# EasyEDA Pro project PCB_SCH_Left_Main.epro

# Schematic left_main

## Sheets
1 led and button: Board Name: left_main; Create Date: 2025-10-24; Page Name: led and button; Project Name: SCH_left_main; Schematic Name: left_main; Update Date: 2025-10-23; Add into BOM: yes; Company: Your Company; Convert to PCB: yes; Date: 10/24/2025; Draw By: Habana; REV: 1.0; Sheet: 1/1; spicePre: .
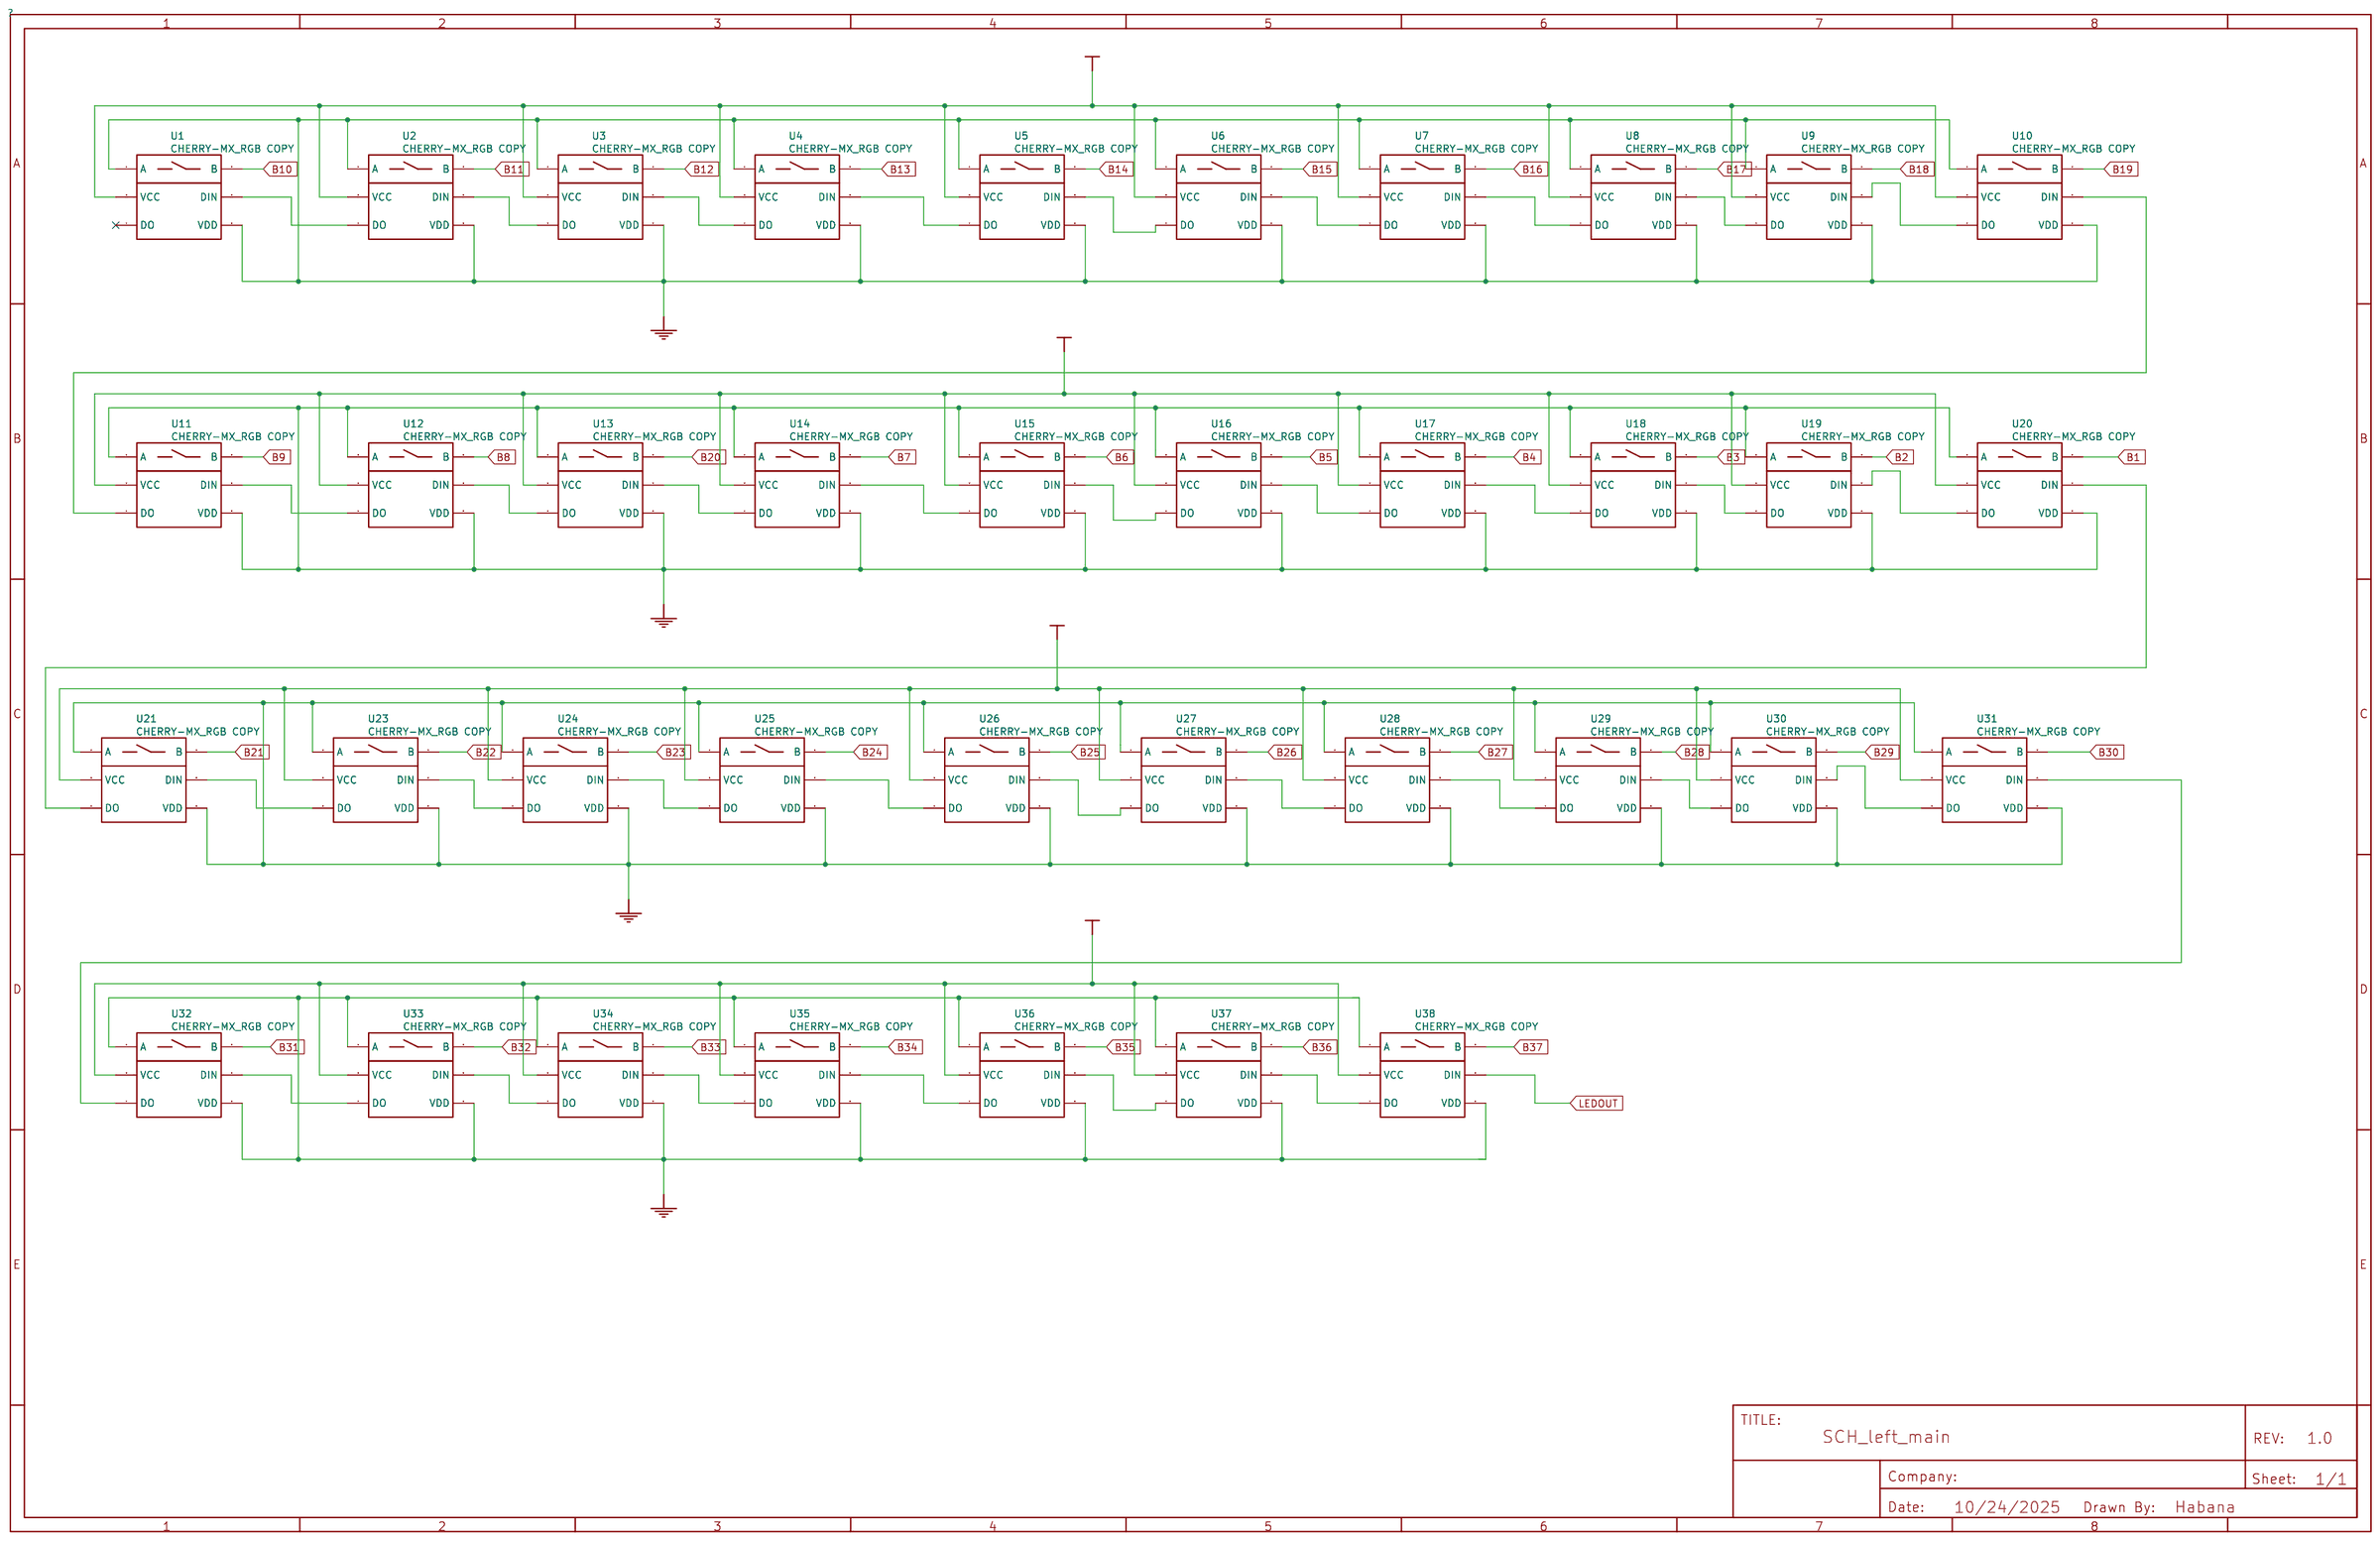
[diagram p0: led and button]
2 drivers: Page Name: drivers
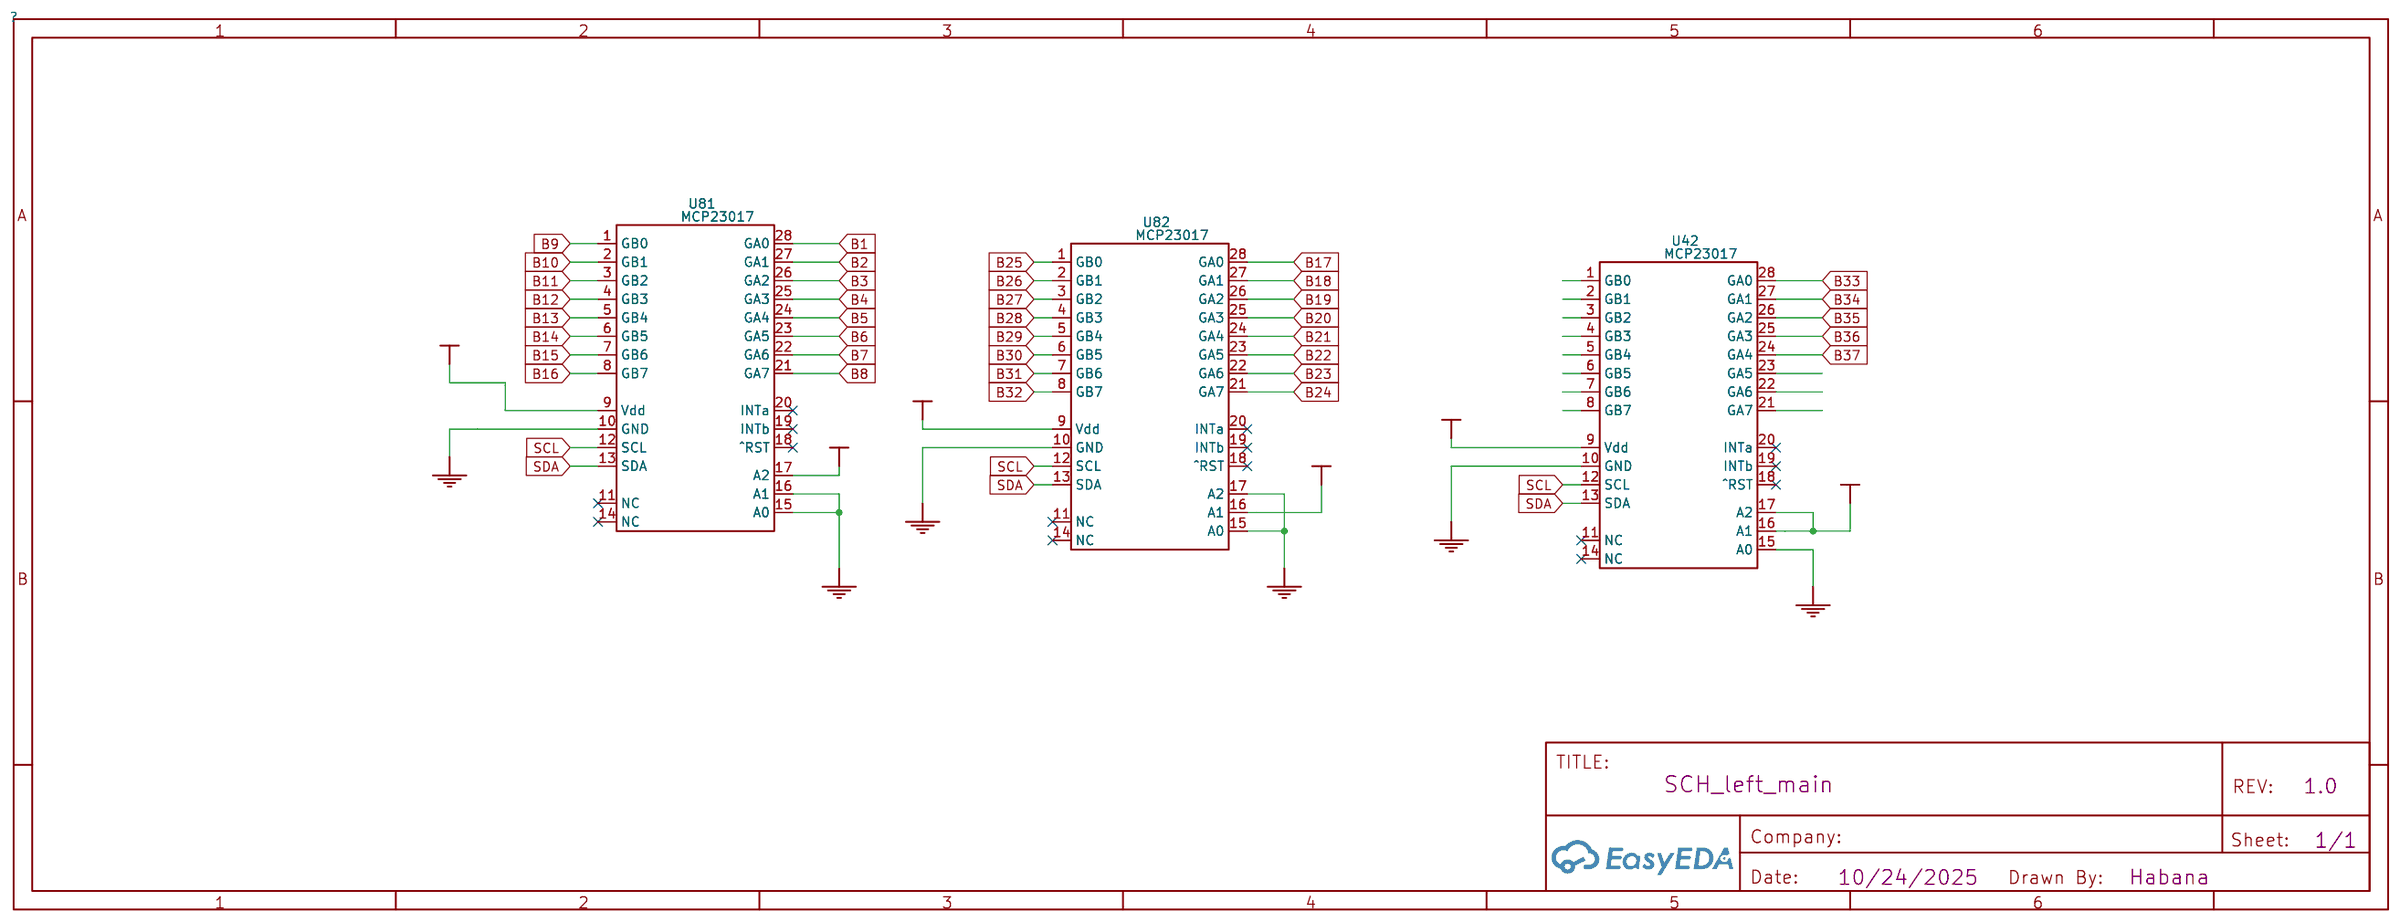
[diagram p1: drivers]
3 microcontroller: Page Name: microcontroller
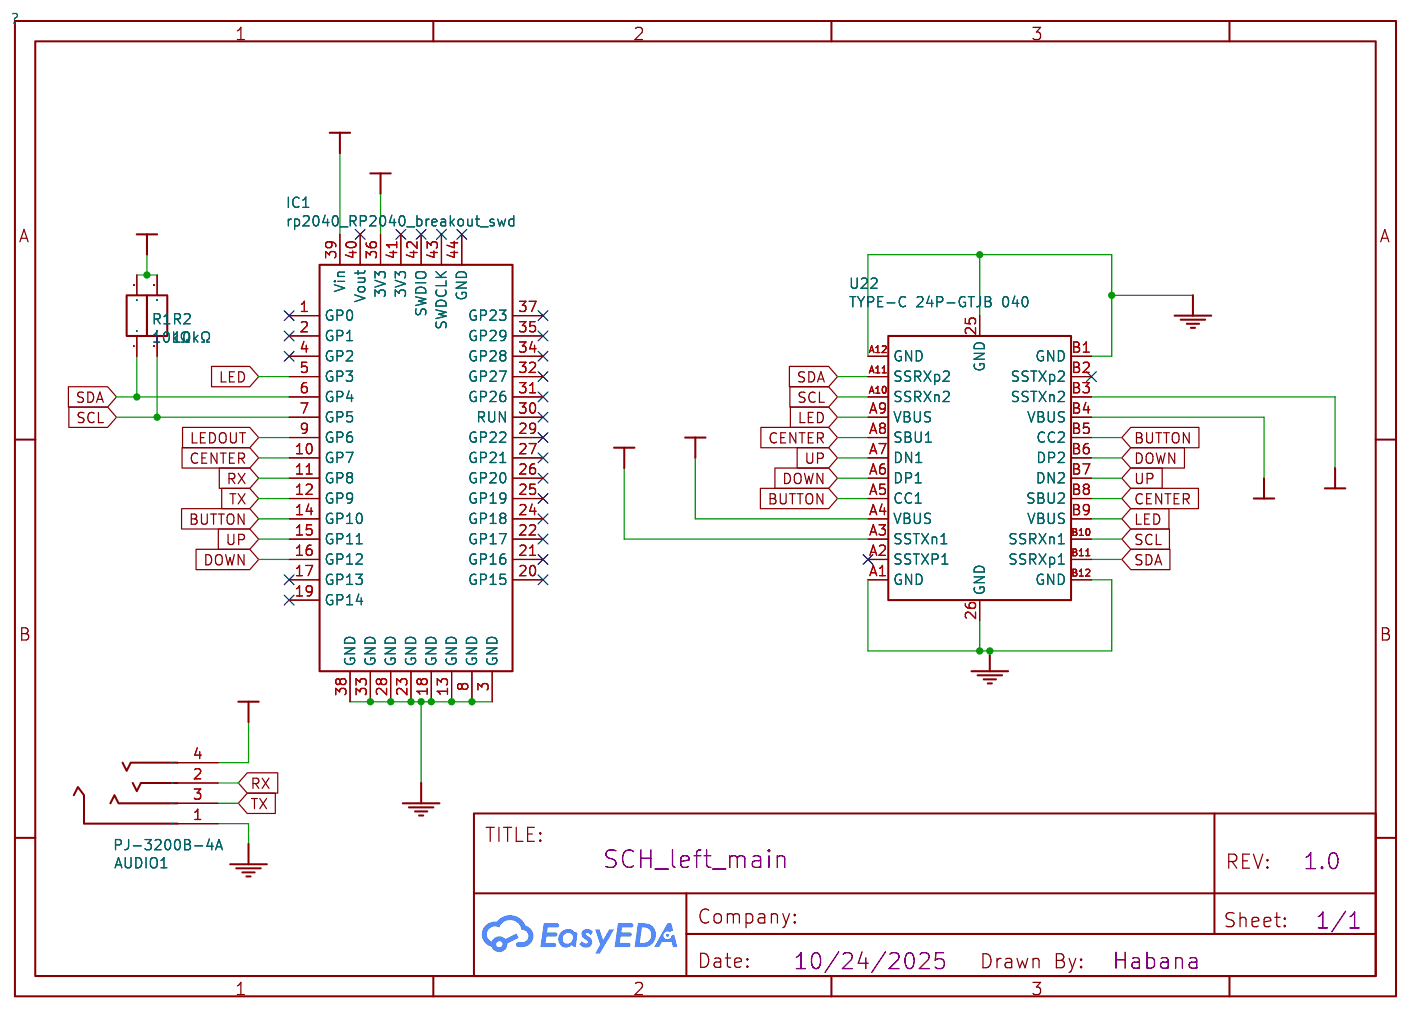
[diagram p2: microcontroller]

## Parts
sheet drivers
U42  MCP23017
U81  MCP23017
U82  MCP23017
sheet led and button
U1  CHERRY-MX_RGB COPY
U2  CHERRY-MX_RGB COPY
U3  CHERRY-MX_RGB COPY
U4  CHERRY-MX_RGB COPY
U5  CHERRY-MX_RGB COPY
U6  CHERRY-MX_RGB COPY
U7  CHERRY-MX_RGB COPY
U8  CHERRY-MX_RGB COPY
U9  CHERRY-MX_RGB COPY
U10  CHERRY-MX_RGB COPY
U11  CHERRY-MX_RGB COPY
U12  CHERRY-MX_RGB COPY
U13  CHERRY-MX_RGB COPY
U14  CHERRY-MX_RGB COPY
U15  CHERRY-MX_RGB COPY
U16  CHERRY-MX_RGB COPY
U17  CHERRY-MX_RGB COPY
U18  CHERRY-MX_RGB COPY
U19  CHERRY-MX_RGB COPY
U20  CHERRY-MX_RGB COPY
U21  CHERRY-MX_RGB COPY
U23  CHERRY-MX_RGB COPY
U24  CHERRY-MX_RGB COPY
U25  CHERRY-MX_RGB COPY
U26  CHERRY-MX_RGB COPY
U27  CHERRY-MX_RGB COPY
U28  CHERRY-MX_RGB COPY
U29  CHERRY-MX_RGB COPY
U30  CHERRY-MX_RGB COPY
U31  CHERRY-MX_RGB COPY
U32  CHERRY-MX_RGB COPY
U33  CHERRY-MX_RGB COPY
U34  CHERRY-MX_RGB COPY
U35  CHERRY-MX_RGB COPY
U36  CHERRY-MX_RGB COPY
U37  CHERRY-MX_RGB COPY
U38  CHERRY-MX_RGB COPY
sheet microcontroller
AUDIO1  PJ-3200B-4A  [AUDIO-TH_PJ-3200B-4A]
IC1  rp2040_RP2040_breakout_swd
R1  10kΩ  [R1206]
R2  10kΩ  [R1206]
U22  TYPE-C 24P-GTJB 040  [USB-C-SMD_TYPE-C-24P-GTJB-040]

## Library data of the parts
U42 U81 U82 = MCP23017: nameAlias: Model; catid: 20; spicePre: X; Contributor: tsvstar
U1-U21 U23-U38 = CHERRY-MX_RGB COPY: Contributor: unrealin01; spicePre: U
AUDIO1 = PJ-3200B-4A: Supplier: LCSC; Manufacturer: 韩国韩荣; Supplier Part: C136687; JLCPCB Part Class: Extended Part; Contributor: LCSC; spicePre: A
IC1 = rp2040_RP2040_breakout_swd: Contributor: rataweb; spicePre: I
R1 R2 = 10kΩ: Supplier: LCSC; Supplier Part: C702863; Manufacturer: HKR(香港电阻); Manufacturer Part: RCT0610KJLF; JLCPCB Part Class: Extended Part; Contributor: LCSC; nameAlias: Value; spicePre: R; spiceSymbolName: RCT0610KJLF
U22 = TYPE-C 24P-GTJB 040: Supplier: LCSC; Supplier Part: C3151751; Manufacturer: SHOU HAN(首韩); JLCPCB Part Class: Extended Part; Contributor: lcsc; spicePre: U

## Nets
+5V: IC1.39(Vin) R1.2 R2.2 U1.3(VCC) U2.3(VCC) U3.3(VCC) U4.3(VCC) U5.3(VCC) U6.3(VCC) U7.3(VCC) U8.3(VCC) U9.3(VCC) U10.3(VCC) U11.3(VCC) U12.3(VCC) U13.3(VCC) U14.3(VCC) U15.3(VCC) U16.3(VCC) U17.3(VCC) U18.3(VCC) U19.3(VCC) U20.3(VCC) U21.3(VCC) U22.A4(VBUS) U22.B4(VBUS) U23.3(VCC) U24.3(VCC) U25.3(VCC) U26.3(VCC) U27.3(VCC) U28.3(VCC) U29.3(VCC) U30.3(VCC) U31.3(VCC) U32.3(VCC) U33.3(VCC) U34.3(VCC) U35.3(VCC) U36.3(VCC) U37.3(VCC) U38.3(VCC)
GND: AUDIO1.1 IC1.3(GND) IC1.8(GND) IC1.13(GND) IC1.18(GND) IC1.23(GND) IC1.28(GND) IC1.33(GND) IC1.38(GND) U1.1(A) U1.5(VDD) U2.1(A) U2.5(VDD) U3.1(A) U3.5(VDD) U4.1(A) U4.5(VDD) U5.1(A) U5.5(VDD) U6.1(A) U6.5(VDD) U7.1(A) U7.5(VDD) U8.1(A) U8.5(VDD) U9.1(A) U9.5(VDD) U10.1(A) U10.5(VDD) U11.1(A) U11.5(VDD) U12.1(A) U12.5(VDD) U13.1(A) U13.5(VDD) U14.1(A) U14.5(VDD) U15.1(A) U15.5(VDD) U16.1(A) U16.5(VDD) U17.1(A) U17.5(VDD) U18.1(A) U18.5(VDD) U19.1(A) U19.5(VDD) U20.1(A) U20.5(VDD) U21.1(A) U21.5(VDD) U22.25(GND) U22.26(GND) U22.A1(GND) U22.A12(GND) U22.B1(GND) U22.B12(GND) U23.1(A) U23.5(VDD) U24.1(A) U24.5(VDD) U25.1(A) U25.5(VDD) U26.1(A) U26.5(VDD) U27.1(A) U27.5(VDD) U28.1(A) U28.5(VDD) U29.1(A) U29.5(VDD) U30.1(A) U30.5(VDD) U31.1(A) U31.5(VDD) U32.1(A) U32.5(VDD) U33.1(A) U33.5(VDD) U34.1(A) U34.5(VDD) U35.1(A) U35.5(VDD) U36.1(A) U36.5(VDD) U37.1(A) U37.5(VDD) U38.1(A) U38.5(VDD) U42.10(GND) U42.15(A0) U81.10(GND) U81.15(A0) U81.16(A1) U82.10(GND) U82.15(A0) U82.17(A2)
VCC: AUDIO1.4 IC1.36(3V3) U22.A3(SSTXn1) U22.B3(SSTXn2) U42.9(Vdd) U42.16(A1) U42.17(A2) U81.9(Vdd) U81.17(A2) U82.9(Vdd) U82.16(A1)
B1: U20.2(B) U81.28(GA0)
B2: U19.2(B) U81.27(GA1)
B3: U18.2(B) U81.26(GA2)
B4: U17.2(B) U81.25(GA3)
B5: U16.2(B) U81.24(GA4)
B6: U15.2(B) U81.23(GA5)
B7: U14.2(B) U81.22(GA6)
B8: U12.2(B) U81.21(GA7)
B9: U11.2(B) U81.1(GB0)
B10: U1.2(B) U81.2(GB1)
B11: U2.2(B) U81.3(GB2)
B12: U3.2(B) U81.4(GB3)
B13: U4.2(B) U81.5(GB4)
B14: U5.2(B) U81.6(GB5)
B15: U6.2(B) U81.7(GB6)
B16: U7.2(B) U81.8(GB7)
B17: U8.2(B) U82.28(GA0)
B18: U9.2(B) U82.27(GA1)
B19: U10.2(B) U82.26(GA2)
B20: U13.2(B) U82.25(GA3)
B21: U21.2(B) U82.24(GA4)
B22: U23.2(B) U82.23(GA5)
B23: U24.2(B) U82.22(GA6)
B24: U25.2(B) U82.21(GA7)
B25: U26.2(B) U82.1(GB0)
B26: U27.2(B) U82.2(GB1)
B27: U28.2(B) U82.3(GB2)
B28: U29.2(B) U82.4(GB3)
B29: U30.2(B) U82.5(GB4)
B30: U31.2(B) U82.6(GB5)
B31: U32.2(B) U82.7(GB6)
B32: U33.2(B) U82.8(GB7)
B33: U34.2(B) U42.28(GA0)
B34: U35.2(B) U42.27(GA1)
B35: U36.2(B) U42.26(GA2)
B36: U37.2(B) U42.25(GA3)
B37: U38.2(B) U42.24(GA4)
BUTTON: IC1.14(GP10) U22.A5(CC1) U22.B5(CC2)
CENTER: IC1.10(GP7) U22.A8(SBU1) U22.B8(SBU2)
DOWN: IC1.16(GP12) U22.A6(DP1) U22.B6(DP2)
LED: IC1.5(GP3) U22.A9(VBUS) U22.B9(VBUS)
LEDOUT: IC1.9(GP6) U38.6(DIN)
RX: AUDIO1.2 IC1.11(GP8)
SCL: IC1.7(GP5) R2.1 U22.A10(SSRXn2) U22.B10(SSRXn1) U42.12(SCL) U81.12(SCL) U82.12(SCL)
SDA: IC1.6(GP4) R1.1 U22.A11(SSRXp2) U22.B11(SSRXp1) U42.13(SDA) U81.13(SDA) U82.13(SDA)
TX: AUDIO1.3 IC1.12(GP9)
UP: IC1.15(GP11) U22.A7(DN1) U22.B7(DN2)
U2_4: U1.6(DIN) U2.4(DO)
U3_4: U2.6(DIN) U3.4(DO)
U4_4: U3.6(DIN) U4.4(DO)
U5_4: U4.6(DIN) U5.4(DO)
U6_4: U5.6(DIN) U6.4(DO)
U7_4: U6.6(DIN) U7.4(DO)
U8_4: U7.6(DIN) U8.4(DO)
U9_4: U8.6(DIN) U9.4(DO)
U10_4: U9.6(DIN) U10.4(DO)
U11_4: U10.6(DIN) U11.4(DO)
U12_4: U11.6(DIN) U12.4(DO)
U13_4: U12.6(DIN) U13.4(DO)
U14_4: U13.6(DIN) U14.4(DO)
U15_4: U14.6(DIN) U15.4(DO)
U16_4: U15.6(DIN) U16.4(DO)
U17_4: U16.6(DIN) U17.4(DO)
U18_4: U17.6(DIN) U18.4(DO)
U19_4: U18.6(DIN) U19.4(DO)
U20_4: U19.6(DIN) U20.4(DO)
U21_4: U20.6(DIN) U21.4(DO)
U23_4: U21.6(DIN) U23.4(DO)
U24_4: U23.6(DIN) U24.4(DO)
U25_4: U24.6(DIN) U25.4(DO)
U26_4: U25.6(DIN) U26.4(DO)
U27_4: U26.6(DIN) U27.4(DO)
U28_4: U27.6(DIN) U28.4(DO)
U29_4: U28.6(DIN) U29.4(DO)
U30_4: U29.6(DIN) U30.4(DO)
U31_4: U30.6(DIN) U31.4(DO)
U31_6: U31.6(DIN) U32.4(DO)
U32_6: U32.6(DIN) U33.4(DO)
U33_6: U33.6(DIN) U34.4(DO)
U34_6: U34.6(DIN) U35.4(DO)
U35_6: U35.6(DIN) U36.4(DO)
U36_6: U36.6(DIN) U37.4(DO)
U37_6: U37.6(DIN) U38.4(DO)

Not connected (* = marked no-connect by the designer): IC1 1(GP0)* 2(GP1)* 4(GP2)* 17(GP13)* 19(GP14)* 20(GP15)* 21(GP16)* 22(GP17)* 24(GP18)* 25(GP19)* 26(GP20)* 27(GP21)* 29(GP22)* 30(RUN)* 31(GP26)* 32(GP27)* 34(GP28)* 35(GP29)* 37(GP23)* 40(Vout)* 41(3V3)* 42(SWDIO)* 43(SWDCLK)* 44(GND)*; U1 4(DO)*; U22 A2(SSTXP1)* B2(SSTXp2)*; U42 1(GB0) 2(GB1) 3(GB2) 4(GB3) 5(GB4) 6(GB5) 7(GB6) 8(GB7) 11(NC)* 14(NC)* 18(^RST)* 19(INTb)* 20(INTa)* 21(GA7) 22(GA6) 23(GA5); U81 11(NC)* 14(NC)* 18(^RST)* 19(INTb)* 20(INTa)*; U82 11(NC)* 14(NC)* 18(^RST)* 19(INTb)* 20(INTa)*

# Board PCB_PCB_left_main
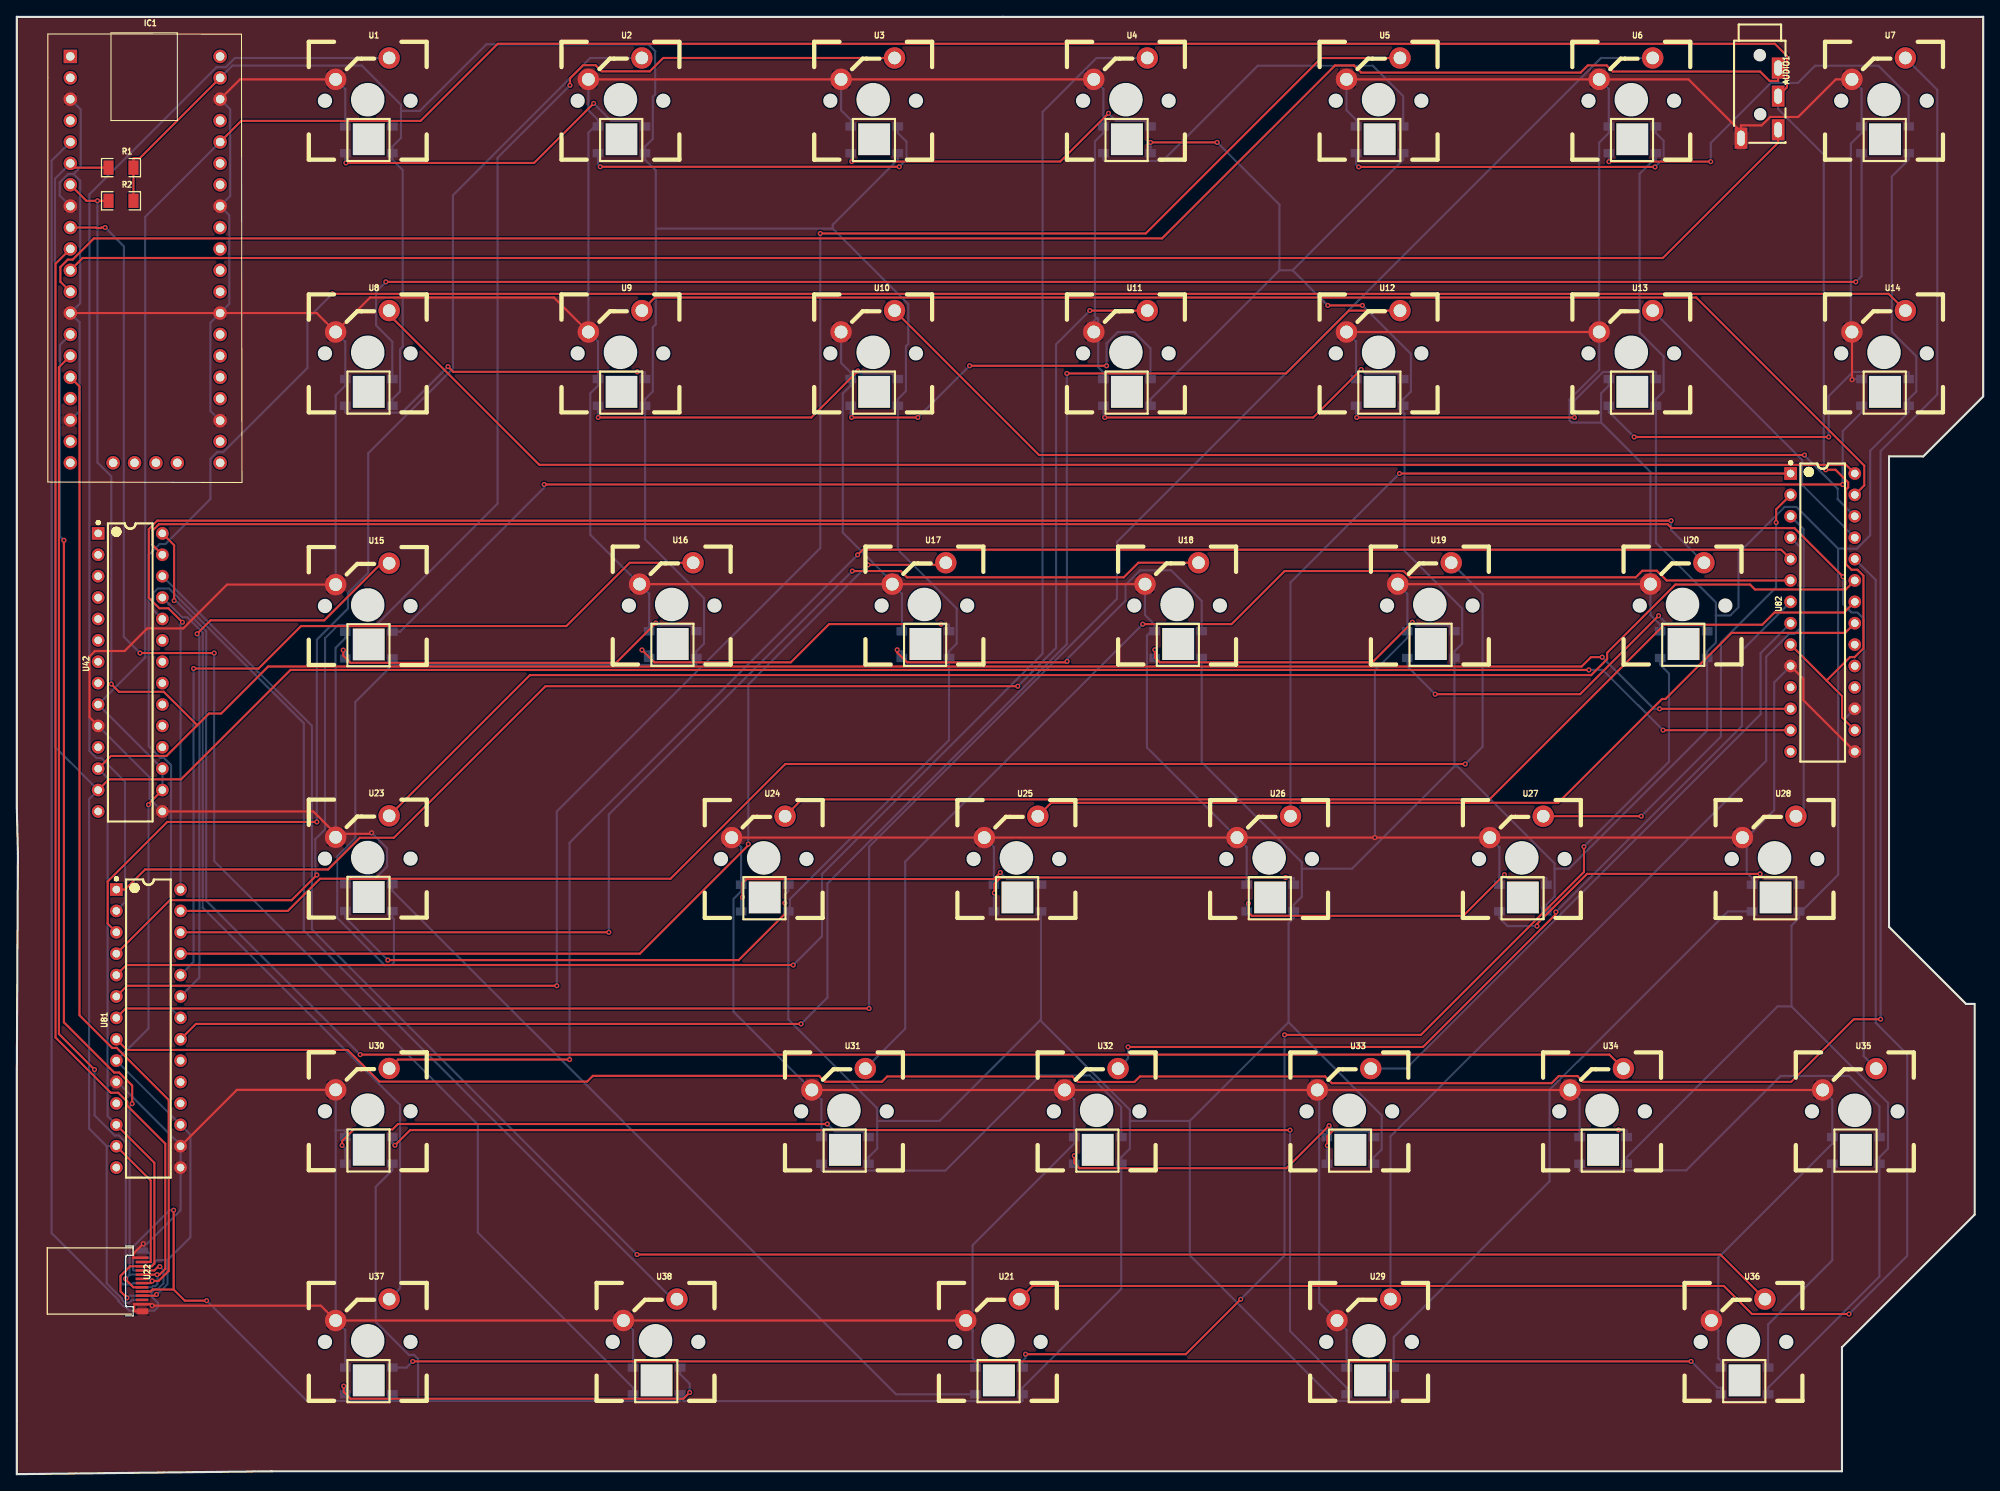
[diagram p3: board, top side]
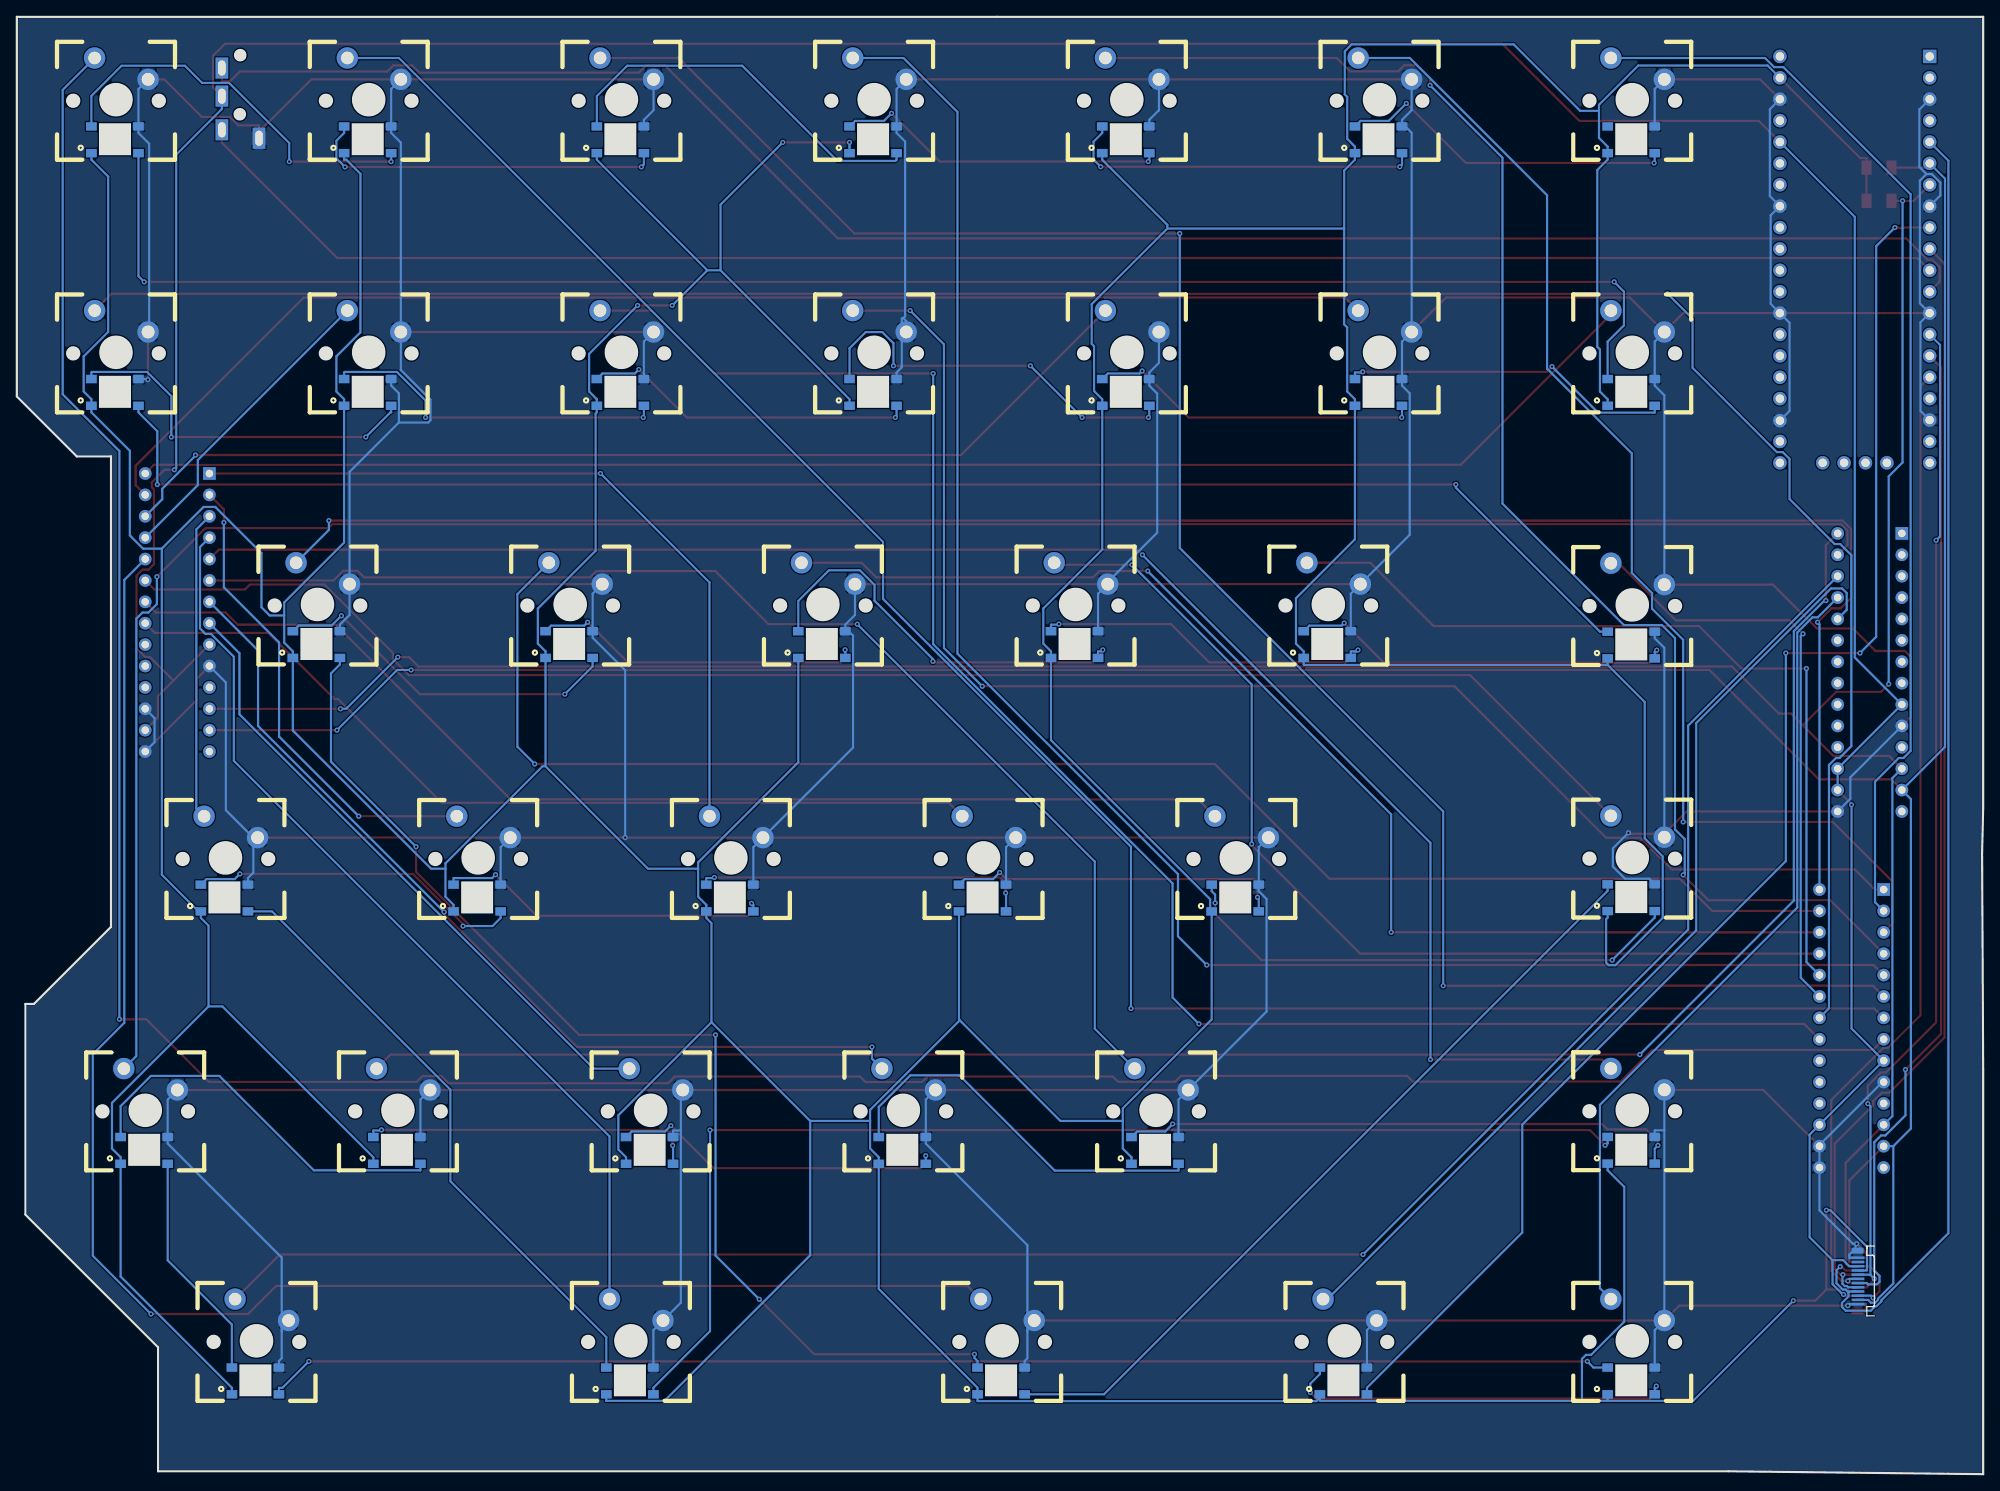
[diagram p4: board, bottom side, seen from below]

Outline 233.43 x 173.06 mm; copper layers: Top Layer, Bottom Layer. Coordinates in mm from the lower left corner of the outline.
Outline path: 0,173.06 0,79.08 0.13,73.75 0,48.13 0,0 30.23,0.34 216.66,0.34 216.66,15.07 232.41,30.82 232.41,55.84 231.39,55.84 222.25,64.98 222.25,120.86 226.31,120.86 233.43,127.98 233.43,173.06 0,173.06

## Design rules (mm)
via Default (default): diameter min 0.61, default 0.61, max 100.025; hole min 0.305, default 0.305, max 59.995
pour e451 uses gge485825
pour e1356 uses gge485849

## Placement (name value [footprint] x y rotation side)
AUDIO1  PJ-3200B-4A  [AUDIO-TH_PJ-3200B-4A]  206.88 162.81 270 top
IC1  rp2040_RP2040_breakout_swd  [RP2040:RP2040-BREAKOUT_SWD]  15.24 144.23 0 top
R1  10kΩ  [R1206]  12.36 155.15 0 top
R2  10kΩ  [R1206]  12.36 151.22 0 top
U1  CHERRY-MX_RGB COPY  [CHERRY-MX-RGB]  43.69 156.24 0 top
U2  CHERRY-MX_RGB COPY  [CHERRY-MX-RGB]  73.69 156.24 0 top
U3  CHERRY-MX_RGB COPY  [CHERRY-MX-RGB]  103.69 156.24 0 top
U4  CHERRY-MX_RGB COPY  [CHERRY-MX-RGB]  133.69 156.24 0 top
U5  CHERRY-MX_RGB COPY  [CHERRY-MX-RGB]  163.69 156.24 0 top
U6  CHERRY-MX_RGB COPY  [CHERRY-MX-RGB]  193.69 156.24 0 top
U7  CHERRY-MX_RGB COPY  [CHERRY-MX-RGB]  223.69 156.24 0 top
U8  CHERRY-MX_RGB COPY  [CHERRY-MX-RGB]  43.69 126.24 0 top
U9  CHERRY-MX_RGB COPY  [CHERRY-MX-RGB]  73.69 126.24 0 top
U10  CHERRY-MX_RGB COPY  [CHERRY-MX-RGB]  103.69 126.24 0 top
U11  CHERRY-MX_RGB COPY  [CHERRY-MX-RGB]  133.69 126.24 0 top
U12  CHERRY-MX_RGB COPY  [CHERRY-MX-RGB]  163.69 126.24 0 top
U13  CHERRY-MX_RGB COPY  [CHERRY-MX-RGB]  193.69 126.24 0 top
U14  CHERRY-MX_RGB COPY  [CHERRY-MX-RGB]  223.69 126.24 0 top
U15  CHERRY-MX_RGB COPY  [CHERRY-MX-RGB]  43.69 96.24 0 top
U16  CHERRY-MX_RGB COPY  [CHERRY-MX-RGB]  79.77 96.3 0 top
U17  CHERRY-MX_RGB COPY  [CHERRY-MX-RGB]  109.77 96.3 0 top
U18  CHERRY-MX_RGB COPY  [CHERRY-MX-RGB]  139.77 96.3 0 top
U19  CHERRY-MX_RGB COPY  [CHERRY-MX-RGB]  169.77 96.3 0 top
U20  CHERRY-MX_RGB COPY  [CHERRY-MX-RGB]  199.77 96.3 0 top
U21  CHERRY-MX_RGB COPY  [CHERRY-MX-RGB]  118.49 8.85 0 top
U22  TYPE-C 24P-GTJB 040  [USB-C-SMD_TYPE-C-24P-GTJB-040]  14.88 22.94 270 top
U23  CHERRY-MX_RGB COPY  [CHERRY-MX-RGB]  43.69 66.24 0 top
U24  CHERRY-MX_RGB COPY  [CHERRY-MX-RGB]  90.69 66.2 0 top
U25  CHERRY-MX_RGB COPY  [CHERRY-MX-RGB]  120.69 66.2 0 top
U26  CHERRY-MX_RGB COPY  [CHERRY-MX-RGB]  150.69 66.2 0 top
U27  CHERRY-MX_RGB COPY  [CHERRY-MX-RGB]  180.69 66.2 0 top
U28  CHERRY-MX_RGB COPY  [CHERRY-MX-RGB]  210.69 66.2 0 top
U29  CHERRY-MX_RGB COPY  [CHERRY-MX-RGB]  162.56 8.85 0 top
U30  CHERRY-MX_RGB COPY  [CHERRY-MX-RGB]  43.69 36.24 0 top
U31  CHERRY-MX_RGB COPY  [CHERRY-MX-RGB]  100.22 36.22 0 top
U32  CHERRY-MX_RGB COPY  [CHERRY-MX-RGB]  130.22 36.22 0 top
U33  CHERRY-MX_RGB COPY  [CHERRY-MX-RGB]  160.22 36.22 0 top
U34  CHERRY-MX_RGB COPY  [CHERRY-MX-RGB]  190.22 36.22 0 top
U35  CHERRY-MX_RGB COPY  [CHERRY-MX-RGB]  220.22 36.22 0 top
U36  CHERRY-MX_RGB COPY  [CHERRY-MX-RGB]  207.01 8.85 0 top
U37  CHERRY-MX_RGB COPY  [CHERRY-MX-RGB]  43.69 8.85 0 top
U38  CHERRY-MX_RGB COPY  [CHERRY-MX-RGB]  77.85 8.85 0 top
U42  MCP23017  [DIP-28_300MIL]  13.46 95.21 90 top
U81  MCP23017  [DIP-28_300MIL]  15.62 52.92 90 top
U82  MCP23017  [DIP-28_300MIL]  214.38 102.32 90 top

## Footprints (pads in the part's own frame, mm; a bottom-side part is the same pattern mirrored in y, then rotated)
AUDIO-TH_PJ-3200B-4A
  rect 2.5x1.5 hole 1.8x0.9: 1(4.17,-2.204) 2(3.17,2.204) 3(-4.17,2.204) 4(-0.831,2.204)
CHERRY-MX-RGB
  round 2.54 hole 1.524: 1(-5.842,9.398)
  round 2.54 hole 1.5: 2(0.508,11.938)
  rect 1.27x1 smd far side: 3(0.889,0.635) 4(0.889,3.81) 5(-4.699,3.81) 6(-4.699,0.635)
DIP-28_300MIL
  rect 1.5x1.5 hole 0.9: 1(16.51,3.81)
  round 1.5 hole 0.9: 2(13.97,3.81) 3(11.43,3.81) 4(8.89,3.81) 5(6.35,3.81) 6(3.81,3.81) 7(1.27,3.81) 8(-1.27,3.81) 9(-3.81,3.81) 10(-6.35,3.81) 11(-8.89,3.81) 12(-11.43,3.81) 13(-13.97,3.81) 14(-16.51,3.81) 15(-16.51,-3.81) 16(-13.97,-3.81) 17(-11.43,-3.81) 18(-8.89,-3.81) 19(-6.35,-3.81) 20(-3.81,-3.81) 21(-1.27,-3.81) 22(1.27,-3.81) 23(3.81,-3.81) 24(6.35,-3.81) 25(8.89,-3.81) 26(11.43,-3.81) 27(13.97,-3.81) 28(16.51,-3.81)
R1206
  rect 1.208x1.701 smd: 1(-1.479,0) 2(1.479,0)
RP2040:RP2040-BREAKOUT_SWD
  rect 1.6x1.6 hole 1.005x1: 1(-8.89,24.13)
  round 1.6 hole 1.005x1: 2(-8.89,21.59) 3(-8.89,19.05) 4(-8.89,16.51) 5(-8.89,13.97) 6(-8.89,11.43) 7(-8.89,8.89) 8(-8.89,6.35) 9(-8.89,3.81) 10(-8.89,1.27) 11(-8.89,-1.27) 12(-8.89,-3.81) 13(-8.89,-6.35) 14(-8.89,-8.89) 15(-8.89,-11.43) 16(-8.89,-13.97) 17(-8.898,-16.506) 18(-8.89,-19.05) 19(-8.89,-21.59) 20(-8.89,-24.13) 21(8.89,-24.13) 22(8.89,-21.59) 23(8.89,-19.122) 24(8.89,-16.51) 25(8.89,-13.97) 26(8.89,-11.43) 27(8.89,-8.89) 28(8.89,-6.35) 29(8.89,-3.81) 30(8.89,-1.27) 31(8.89,1.27) 32(8.89,3.81) 33(8.89,6.35) 34(8.89,8.89) 35(8.89,11.43) 36(8.89,13.97) 37(8.89,16.51) 38(8.89,19.05) 39(8.89,21.59) 40(8.89,24.13) 41(-3.81,-24.13) 42(-1.27,-24.13) 43(1.27,-24.13) 44(3.81,-24.13)
USB-C-SMD_TYPE-C-24P-GTJB-040
  rect 0.7x1.4 smd: 25(3.6,0.025)
  rect 0.7x1.4 smd far side: 26(-3.6,0.025)
  rect 0.3x1.5 smd: A1(2.75,-0.025) A2(2.25,-0.025) A3(1.75,-0.025) A4(1.25,-0.025) A5(0.75,-0.025) A6(0.25,-0.025) A7(-0.25,-0.025) A8(-0.75,-0.025) A9(-1.25,-0.025) A10(-1.75,-0.025) A11(-2.25,-0.025) A12(-2.75,-0.025)
  rect 0.3x1.5 smd far side: B1(-2.75,-0.025) B2(-2.25,-0.025) B3(-1.75,-0.025) B4(-1.25,-0.025) B5(-0.75,-0.025) B6(-0.25,-0.025) B7(0.25,-0.025) B8(0.75,-0.025) B9(1.25,-0.025) B10(1.75,-0.025) B11(2.25,-0.025) B12(2.75,-0.025)

## Nets
As in the schematic.

Pads without a net: IC1 1 2 4 17 19 20 21 22 24 25 26 27 29 30 31 32 34 35 37 40 41 42 43 44; U1 4; U22 A2 B2; U42 1 2 3 4 5 6 7 8 11 14 18 19 20 21 22 23; U81 11 14 18 19 20; U82 11 14 18 19 20

## Via types
v1: diameter 0.61, hole 0.305, Top Layer to Bottom Layer, 131 vias

## Routing (per net, layer and track width the routed paths; a pad name or vN(x,y) marks a point on that pad's centre or on a via; arc(x,y) is an arc through that point)
+5V: length 1347.2
  Top Layer w0.254: 18.62,21.93 16.12,21.93 15.89,21.69 U22.A4 ; 18.62,21.93 19.94,20.6 v1(22.53,20.6) ; 18.62,21.93 v1(18.62,31.35) ; 24.13,165.82 14.59,156.28 13.84,156.28 R1.2 R2.2 ; v1(159.74,138.79) v1(155.62,138.79) ; v1(134.58,158.15) v1(142.5,158.15)
  Bottom Layer w0.254: 102.13,41.95 109.54,41.95 121.49,53.9 ; 102.13,41.95 102.13,43.44 91.58,53.99 U24.3 91.76,67.01 91.76,68.27 110.66,87.17 U17.3 110.66,97.71 111.58,98.63 111.58,102.8 104.58,109.8 U10.3 104.58,127.65 105.54,128.62 105.54,133.94 105.83,134.23 105.83,138.94 96.85,147.92 ; 102.13,41.95 102.13,38.67 101.11,37.64 U31.3 ; 170.66,84.06 158.49,71.89 152.55,71.89 ; 170.66,84.06 U19.3 170.66,97.71 171.58,98.63 171.58,102.8 164.72,109.65 164.72,125.95 164.58,126.1 U12.3 164.58,127.65 165.49,128.57 165.49,133.04 v1(159.74,138.79) ; 170.66,84.06 171.02,84.06 182.55,72.53 182.55,71.89 ; 151.45,142.97 v1(155.62,138.79) ; 151.45,142.97 164.58,156.1 U5.3 ; 151.45,142.97 149.89,142.97 ; U34.3 191.11,37.64 209.02,55.55 210.67,55.55 ; 152.55,71.89 152.55,68.57 151.58,67.61 U26.3 151.58,66.05 150.97,65.44 150.97,53.67 ; 152.55,71.89 152.55,72.65 140.66,84.53 U18.3 ; U11.3 134.58,127.65 149.89,142.97 ; U15.3 44.58,96.1 ; 44.58,96.1 40.18,91.7 40.18,75.5 38.04,73.36 38.04,66.06 43.66,60.44 44.45,60.44 44.76,60.75 44.76,65.91 44.58,66.1 U23.3 ; 44.58,96.1 80.6,96.1 80.66,96.15 U16.3 80.66,97.71 81.58,98.62 81.58,104.01 74.58,111.01 U9.3 74.58,127.65 75.49,128.57 75.49,136.19 75.85,136.55 75.85,147.92 ; 121.49,53.9 121.58,53.99 U25.3 ; 121.49,53.9 132.13,43.26 132.13,41.95 ; U29.3 163.45,8.71 163.45,8.7 156.53,8.7 139.24,25.99 139.24,41.95 ; U3.3 104.58,156.1 96.85,148.37 96.85,147.92 ; U33.3 161.11,37.64 162.02,38.55 162.02,42.62 150.97,53.67 ; 201.69,101.97 203.41,101.97 204.38,102.94 204.38,109.37 209.87,114.86 211.26,114.86 216.21,109.91 ; 201.69,101.97 201.69,103.51 194.58,110.62 U13.3 194.58,127.65 195.49,128.57 195.49,132.74 192.64,135.59 192.64,154.42 194.31,156.1 194.58,156.1 U6.3 ; 201.69,101.97 201.69,98.74 200.66,97.71 U20.3 200.66,88.31 184.24,71.89 182.55,71.89 ; 150.97,53.67 139.24,41.95 ; 139.24,41.95 132.13,41.95 ; 216.21,109.91 216.21,71.19 211.58,66.56 ; 216.21,109.91 218.44,109.91 220.01,111.48 220.01,121.53 224.58,126.1 U14.3 224.58,127.65 225.49,128.57 225.49,132.74 222.58,135.65 222.58,154.1 224.58,156.1 U7.3 ; U38.3 78.74,9.09 ; 78.74,9.09 79.16,8.67 119.35,8.67 119.38,8.71 U21.3 119.38,10.26 131.11,21.99 U32.3 131.11,37.64 132.13,38.67 132.13,41.95 ; 78.74,9.09 78.74,8.71 78.74,8.7 47.63,8.7 47.63,8.71 ; U27.3 181.58,67.61 182.55,68.57 182.55,71.89 ; v1(134.58,158.15) 134.58,157.66 134.58,157.65 U4.3 ; U37.3 44.58,8.71 ; 44.58,8.71 47.63,8.71 ; 44.58,8.71 44.58,8.7 34.43,8.7 v1(22.53,20.6) ; 47.63,8.71 47.63,13.68 47.15,14.16 46.54,14.16 42.6,18.11 42.6,34.12 44.58,36.09 U30.3 ; 149.89,142.97 149.89,150.76 v1(142.5,158.15) ; 75.85,147.92 75.85,154.82 74.58,156.1 U2.3 74.58,157.65 75.49,158.57 75.49,163.57 75.78,163.86 75.78,168.97 74.95,169.8 55.74,169.8 47.83,161.9 45.6,161.9 ; 75.85,147.92 96.85,147.92 ; 210.67,55.55 222.13,44.09 222.13,38.67 221.11,37.64 U35.3 221.11,23.47 207.9,10.26 U36.3 ; 210.67,55.55 210.67,65.14 211.58,66.05 211.58,66.56 ; 45.6,161.9 45.6,162.62 40.95,167.28 25.59,167.28 24.13,165.82 ; 45.6,161.9 45.6,158.68 44.58,157.65 U1.3 44.58,156.1 45.81,154.86 45.81,133.88 45.49,133.57 45.49,128.57 44.58,127.65 U8.3 ; v1(18.62,31.35) 18.13,31.35 13.79,27 13.79,24.23 13.83,24.19 U22.B4 ; U28.3 211.58,66.56
GND: length 1587
  Top Layer w0.254: 157.85,135.64 187.85,135.64 ; U4.1 U3.1 U2.1 ; 204.68,159.41 204.68,160.17 207.14,160.17 208.14,161.18 211.47,161.18 215.93,165.64 U7.1 ; 204.68,159.41 AUDIO1.1 ; 204.68,159.41 198.45,165.64 U6.1 U5.1 ; U19.1 U20.1 ; 37.85,105.64 24.95,105.64 19.76,100.44 15.48,100.44 12.79,97.75 9.27,97.75 8.62,97.1 8.62,89.89 9.65,88.86 ; U16.1 U17.1 U18.1 ; U1.1 26.49,165.64 IC1.38 ; U81.16 26.12,45.64 U30.1 ; 37.85,76.05 42,76.05 v1(42.11,76.16) ; 37.85,76.05 35.19,78.7 U42.15 ; 37.85,76.05 37.85,75.64 ; U31.1 U32.1 U33.1 U34.1 U35.1 ; 67.85,135.64 63.75,139.73 41.94,139.73 37.85,135.64 35.6,137.88 IC1.28 IC1.13 ; U24.1 U25.1 U26.1 v1(161.21,75.59) U27.1 U28.1 ; 210.57,95.97 212.07,94.46 212.07,91.92 U82.15 ; v1(15.02,27.36) 13.83,26.18 13.83,25.69 U22.A12 ; v1(217.87,129.98) 217.87,135.62 217.85,135.64 ; U21.1 U38.1 U37.1 36.08,20.01 v1(16.07,20.01) 15.89,20.19 U22.A1 13.93,20.19 13.93,19.42 14.01,19.34 U22.25
  Bottom Layer w0.254: U30.1 37.85,40.83 ; 37.85,40.83 38.99,40.83 U30.5 ; 37.85,40.83 U37.1 38.99,17.1 U37.5 ; U27.1 175.99,74.45 U27.5 ; U34.1 185.52,44.48 185.52,40.03 ; 95.52,40.03 95.52,44.48 U31.1 85.07,54.93 85.07,68.3 85.99,69.23 U24.5 85.99,74.45 U24.1 ; v1(16.07,20.01) 15.89,20.19 U22.A1 ; 15.15,26.54 15.4,26.54 15.89,26.05 15.89,25.69 U22.A12 ; 15.15,26.54 15.15,27.36 ; 15.15,26.54 U22.26 ; 155.52,40.03 155.52,40.81 154.6,40.81 ; U16.5 75.07,104.55 U16.1 68.07,111.55 68.07,128.35 68.99,129.27 68.99,134.49 67.85,135.64 67.85,159.3 68.99,160.44 ; U26.5 145.99,74.45 U26.1 134.16,86.29 134.16,99.58 135.07,100.49 ; 205.36,75.59 U28.1 ; 205.36,75.59 208.62,78.86 208.62,94.02 210.57,95.97 ; 205.36,75.59 205.36,71.42 205.99,70.79 U28.5 ; IC1.18 7.44,126.28 7.44,136.79 IC1.13 7.52,139.05 7.52,153.61 6.74,154.39 ; 6.74,154.39 7.58,155.23 7.58,162.05 IC1.3 ; 6.74,154.39 6.09,154.39 5.08,153.38 5.08,151.85 IC1.8 ; 127.85,135.64 127.85,136.94 128.19,137.29 ; 217.85,135.64 217.72,135.76 217.72,158 218.99,159.27 U7.5 218.99,164.49 U7.1 ; 9.65,88.86 15.76,82.75 15.76,80.21 U42.15 ; U18.5 135.07,100.49 ; 135.07,100.49 135.07,100.88 133.93,102.03 U18.1 ; v1(15.02,27.36) 15.15,27.36 ; 15.15,27.36 15.46,27.36 19.43,31.33 U81.15 U81.16 19.43,39.08 11.95,46.57 U81.10 ; U38.5 73.15,17.1 U38.1 ; U35.1 215.52,44.48 215.52,39.26 201.98,25.72 201.98,16.93 ; U21.5 113.79,13.44 113.46,13.77 113.46,16.93 ; 188.07,124.88 188.07,128.35 188.99,129.27 188.99,130.05 ; 188.07,124.88 193.93,119.03 U20.1 193.93,102.03 195.07,100.88 U20.5 ; 188.07,124.88 184.59,124.88 184.32,125.15 184.32,127.6 187.85,131.13 187.85,158.13 188.99,159.27 U6.5 188.99,164.49 U6.1 ; U1.1 38.99,164.49 U1.5 ; 37.85,135.64 38.99,134.49 38.99,129.27 37.85,128.13 37.85,105.64 ; U23.5 39.65,70.71 42.52,70.71 43.95,72.15 43.95,74.32 v1(42.11,76.16) ; 128.19,137.29 128.3,137.29 128.37,137.21 128.37,131.45 128.99,130.83 128.99,130.05 ; 128.19,137.29 127.98,137.5 127.98,158.26 128.99,159.27 U4.5 128.99,164.49 U4.1 ; U17.5 105.07,104.55 U17.1 103.93,105.93 98.05,111.81 98.05,128.33 98.99,129.27 98.99,130.83 97.85,131.97 97.85,135.64 ; 201.98,16.93 201.98,17.43 U36.1 ; 201.98,16.93 201.98,13.77 202.31,13.44 202.31,12.66 ; U25.5 115.99,74.45 U25.1 ; 154.6,40.81 154.6,45.4 U33.1 ; 154.6,40.81 154.6,20.36 U29.1 157.86,17.1 U29.5 ; IC1.23 22.98,126.26 22.98,136.73 IC1.28 25.22,138.97 25.22,149.49 IC1.33 25.33,151.78 25.33,162.09 IC1.38 ; U21.1 113.46,17.43 113.46,16.93 ; v1(161.21,75.59) 161.21,95.47 165.07,99.33 U19.5 165.07,104.55 U19.1 ; U3.5 98.99,160.83 97.85,161.97 U3.1 ; U32.1 125.52,44.48 125.52,39.26 113.46,27.2 113.46,16.93 ; 68.99,160.44 68.99,160.83 67.85,161.97 U2.1 ; 68.99,160.44 U2.5 ; 218.19,90.89 217.08,89.79 217.08,86.91 U82.15 ; U5.5 158.99,160.83 157.85,161.97 U5.1 ; 158.99,130.05 158.99,134.49 157.85,135.64 ; v1(217.87,129.98) 218,129.98 218.07,130.05 218.99,130.05 ; 37.85,75.64 37.85,98.13 38.99,99.27 U15.5
VCC: length 445.7
  Top Layer w0.254: v1(214.73,119.28) 215.9,119.28 217.4,117.77 217.4,117.19 217.16,116.94 217.16,108.05 217.8,107.4 218.51,107.4 219.22,106.69 219.22,98.08 218.17,97.03 217.62,97.03 214.84,94.24 ; U82.16 216.68,89.86 216.68,92.4 214.84,94.24 ; v1(15.63,79.5) 15.63,79.6 17.27,81.24 ; IC1.36 26.64,160.71 47.94,160.71 57.09,169.86 208.71,169.86 210.13,168.44 210.13,164.69 AUDIO1.4 ; 214.84,94.24 U82.9 ; U22.A3 16.43,21.19 v1(16.58,21.34)
  Bottom Layer w0.254: IC1.36 15.24,149.31 15.24,96.99 U42.9 17.27,83.78 17.27,81.24 ; AUDIO1.4 209.09,162.12 214.5,156.7 214.5,119.51 v1(214.73,119.28) ; 17.88,25.41 20.6,28.14 20.6,40.32 U81.17 U81.9 15.63,52.93 v1(15.63,79.5) ; 17.88,25.41 17.88,22.56 16.66,21.34 v1(16.58,21.34) ; 17.88,25.41 16.61,25.41 15.89,24.69 U22.B3
B1: length 232.9
  Top Layer w0.254: v1(196.38,113.23) 16.67,113.23 15.66,112.23 15.66,104.07 16.9,102.83 17.99,102.83 v1(19.66,101.17)
  Bottom Layer w0.254: v1(196.38,113.23) 196.38,112.13 U20.2 ; U81.28 19.43,100.94 v1(19.66,101.17)
B2: length 186
  Top Layer w0.254: U81.27 32.17,66.89 35.99,70.71 77.6,70.71 91.22,84.33 v1(171.95,84.33)
  Bottom Layer w0.254: U19.2 174,104.51 174,86.39 v1(171.95,84.33)
B3: length 147.8
  Top Layer w0.254: U18.2 133.14,108.23 131.41,106.5 105.67,106.5 104.92,107.24 v1(99.18,107.24) ; U81.26 v1(70.28,64.35)
  Bottom Layer w0.254: v1(99.18,107.24) 70.28,78.34 v1(70.28,64.35)
B4: length 121.3
  Top Layer w0.254: U17.2 110.03,107.99 v1(101.05,107.99) ; v1(86.83,74.83) 86.83,74.69 73.95,61.81 U81.25
  Bottom Layer w0.254: v1(86.83,74.83) 86.83,93.77 v1(101.05,107.99)
B5: length 101.5
  Top Layer w0.254: U16.2 72.75,108.23 65.23,100.71 33.73,100.71 28.69,95.67 v1(20.98,95.67)
  Bottom Layer w0.254: v1(20.98,95.67) 20.98,60.82 U81.24
B6: length 70.4
  Top Layer w0.254: v1(21.39,99.8) 22.99,101.4 36.5,101.4 43.28,108.18 U15.2
  Bottom Layer w0.254: v1(21.39,99.8) 21.66,99.52 21.66,58.96 U81.23
B7: length 285.2
  Top Layer w0.254: v1(37.46,140.17) 222.2,140.17 224.2,138.18
  Bottom Layer w0.254: v1(37.46,140.17) 34.5,137.21 34.5,131.37 24.5,121.37 23.78,121.37 22.98,120.57 22.98,115.8 17.63,110.45 16.95,110.45 15.65,109.14 15.65,86.45 17.05,85.05 17.47,85.05 18.3,84.21 18.3,55.32 U81.22
B8: length 207.4
  Top Layer w0.254: 164.2,138.18 158.13,138.18 150.67,130.71 v1(124.65,130.71) ; v1(93.1,53.47) 21.25,53.47 U81.21
  Bottom Layer w0.254: v1(124.65,130.71) 124.65,98.57 96.23,70.15 96.23,56.6 v1(93.1,53.47)
B9: length 172
  Top Layer w0.254: U81.1 12.84,69.43 15.23,71.81 36.94,71.81 40.71,75.58 44.76,75.58 62.75,93.57 v1(118.82,93.57) ; 134.2,138.18 v1(127.37,138.18)
  Bottom Layer w0.254: v1(118.82,93.57) 123.37,98.12 123.37,134.17 v1(127.37,138.18)
B10: length 129.9
  Bottom Layer w0.254: U81.2 12.84,67.92 12.84,82.23 10.02,85.05 9.45,85.05 8.61,85.89 8.61,151.99 23.71,167.09 24.81,167.09 25.9,168.18 U1.2
B11: length 144.5
  Top Layer w0.254: U81.3 10.78,65.38 10.78,70.39 17.85,77.46 v1(35.61,77.46)
  Bottom Layer w0.254: U2.2 68.07,168.18 51.77,151.88 51.77,131.29 41.71,121.22 41.71,107.03 39.3,104.63 39.3,102.79 35.61,99.09 v1(35.61,77.46)
B12: length 177.6
  Top Layer w0.254: U81.4 18.16,68.16 32.61,68.16 v1(35.61,71.16) ; v1(65.66,164.93) 65.66,165.75 67.23,167.32 68.71,167.32 69.43,166.59 75.15,166.59 76.74,168.18 U3.2
  Bottom Layer w0.254: v1(65.66,164.93) 57.06,156.33 57.06,115.25 42.64,100.83 38.13,100.83 36.58,99.28 36.58,76.57 35.43,75.41 35.43,71.34 v1(35.61,71.16)
B13: length 209.5
  Top Layer w0.254: U81.5 13,60.46 v1(92.17,60.46)
  Bottom Layer w0.254: U4.2 128.17,168.18 121.76,161.77 121.76,97.44 95.59,71.26 95.59,63.88 v1(92.17,60.46)
B14: length 232.6
  Top Layer w0.254: U81.6 13.08,58 v1(64.1,58) ; U5.2 154.84,168.18 134,147.34 v1(95.38,147.34)
  Bottom Layer w0.254: v1(95.38,147.34) 95.38,109.98 64.1,78.7 v1(64.1,58)
B15: length 244.8
  Top Layer w0.254: v1(101.17,55.3) 12.92,55.3 U81.7
  Bottom Layer w0.254: U6.2 188.07,168.18 130.6,110.71 130.6,103.94 101.17,74.51 v1(101.17,55.3)
B16: length 335.5
  Top Layer w0.254: U81.8 13.08,50.38 39.27,50.38 43.03,46.62 67.7,46.62 68.38,47.3 95.24,47.3 95.94,46.6 102.7,46.6 103.33,47.23 125.31,47.23 125.97,46.57 132.67,46.57 133.33,47.23 155.31,47.23 156.11,46.43 182.2,46.43 183.05,47.28 185.26,47.28 185.95,46.59 210.63,46.59 218.07,54.02 v1(221.25,54.02)
  Bottom Layer w0.254: v1(221.25,54.02) 221.25,121.5 227.99,128.24 227.99,164.39 U7.2
B17: length 182.3
  Top Layer w0.254: 44.2,138.18 44.2,137.69 62.02,119.86 217.16,119.86 U82.28
B18: length 158
  Top Layer w0.254: 74.2,138.18 75.75,139.73 199.36,139.73 219.32,119.77 219.32,117.42 U82.27
B19: length 124.9
  Top Layer w0.254: v1(212.22,121.03) 121.35,121.03 104.2,138.18
  Bottom Layer w0.254: U82.26 216.16,115.77 216.16,117.02 212.22,120.96 v1(212.22,121.03)
B20: length 36.9
  Bottom Layer w0.254: U82.25 211.94,117.46 211.94,120.43 194.2,138.18
B21: length 195.6
  Top Layer w0.254: U21.2 120.57,22.36 202.64,22.36 205.97,19.02 v1(217.5,19.02)
  Bottom Layer w0.254: v1(217.5,19.02) 224.41,25.93 224.41,49.86 220.67,53.6 220.67,106.19 U82.24
B22: length 186.5
  Top Layer w0.254: U82.23 217.11,105.06 206.34,105.06 205.75,105.65 196.89,105.65 188.79,97.54 188.79,96.78 186.89,94.89 60.91,94.89 U23.2
B23: length 137.5
  Top Layer w0.254: U24.2 93.2,80.13 174.81,80.13 195.55,100.87 207.2,100.87 208.65,102.32 216.92,102.32 U82.22
B24: length 106.5
  Top Layer w0.254: 121.2,78.13 122.79,79.72 182.98,79.72 195.3,92.05 195.71,92.05 203.56,99.9 217.04,99.9 U82.21
B25: length 92.5
  Top Layer w0.254: U82.1 v1(164.13,118.83)
  Bottom Layer w0.254: 151.2,78.13 151.2,105.9 v1(164.13,118.83)
B26: length 57.1
  Top Layer w0.254: v1(208.85,113.01) 208.85,114.57 U82.2 ; v1(192.84,78.13) 181.2,78.13
  Bottom Layer w0.254: v1(208.85,113.01) 208.85,105.32 202.3,98.77 202.3,87.59 v1(192.84,78.13)
B27: length 36.6
  Bottom Layer w0.254: U82.3 212.12,112.2 212.12,79.05 211.2,78.13
B28: length 111.4
  Bottom Layer w0.254: U82.4 211.68,110.1 211.68,100.43 211.03,99.78 210.38,99.78 207.67,97.07 207.67,84.71 163.07,40.11 U29.2
B29: length 207.4
  Top Layer w0.254: U30.2 45.25,49.24 v1(65.61,49.24) ; U82.5 209.45,109.78 100.42,109.78 v1(99.81,109.17)
  Bottom Layer w0.254: v1(65.61,49.24) 65.61,74.97 v1(99.81,109.17)
B30: length 147.1
  Top Layer w0.254: U82.6 195.84,106.13 194.69,107.28 192.98,107.28 192.19,106.5 165.38,106.5 164.63,107.25 150.5,107.25 144.19,100.94 v1(133.66,100.94)
  Bottom Layer w0.254: U31.2 105.46,52.89 105.46,72.74 v1(133.66,100.94)
B31: length 109
  Top Layer w0.254: v1(131.91,50.73) 166.93,50.73 182.7,66.5 v1(182.7,66.76)
  Bottom Layer w0.254: U32.2 131.91,49.35 v1(131.91,50.73) ; U82.7 204.79,97.82 204.79,88.85 v1(182.7,66.76)
B32: length 76
  Bottom Layer w0.254: U82.8 207,97.49 207,90.23 164.93,48.16 U33.2
B33: length 222.4
  Top Layer w0.254: 17.27,111.72 18.67,110.32 v1(18.67,103.74) ; v1(40.76,49.82) 189.07,49.82 U34.2
  Bottom Layer w0.254: v1(40.76,49.82) 22.48,68.1 22.48,100.11 18.85,103.74 v1(18.67,103.74)
B34: length 267.4
  Top Layer w0.254: v1(216.8,106.57) 211.03,112.34 196.44,112.34 195.97,112.81 16.87,112.81 16.1,112.05 16.1,110.35 U42.27
  Bottom Layer w0.254: U35.2 219.24,49.65 219.24,101.59 218.51,102.32 217.8,102.32 216.8,103.32 v1(216.8,106.57)
B35: length 240
  Top Layer w0.254: U36.2 202.22,26.08 v1(73.62,26.08)
  Bottom Layer w0.254: v1(73.62,26.08) 35.02,64.68 35.02,88.89 U42.26
B36: length 95.9
  Bottom Layer w0.254: U37.2 45.49,22.08 45.49,43.85 22.07,67.28 22.07,99.94 20.26,101.75 19.62,101.75 17.27,104.1
B37: length 115.3
  Bottom Layer w0.254: U38.2 77.85,20.79 34.07,64.57 34.07,89.17 18.06,105.18 16.73,105.18 16.2,104.64 16.2,102.63 U42.24
BUTTON: length 120.8
  Top Layer w0.254: v1(13.69,44) 13.69,46.15 12.14,47.69 11.55,47.69 5.58,53.66 v1(5.58,110.9) ; U22.A5 13.83,22.19 12.92,23.1 v1(12.92,23.2)
  Bottom Layer w0.254: 13.38,23.69 13.38,23.66 v1(12.92,23.2) ; 13.38,23.69 U22.B5 ; 13.38,23.69 13.38,43.69 v1(13.69,44) ; v1(5.58,110.9) 5.12,111.36 5.12,134.11 IC1.14
CENTER: length 133.9
  Top Layer w0.254: IC1.10 4.59,143.74 4.59,51.85 11.14,45.3 12.04,45.3 13.1,44.23 13.1,43.76 17.62,39.24 17.62,24.38 16.94,23.69 v1(16.65,23.69) U22.A8
  Bottom Layer w0.254: v1(16.65,23.69) 16.7,23.64 16.7,22.61 16.43,22.33 16.17,22.33 16.03,22.19 U22.B8
DOWN: length 116.4
  Top Layer w0.254: U22.A6 15.89,22.69 15.89,22.76 v1(16.07,22.94) 16.83,22.94 18.03,24.15 18.03,44.44 11.85,50.62 11.32,50.62 7.44,54.5 7.44,129.17 IC1.16
  Bottom Layer w0.254: U22.B6 15.89,23.19 15.89,23.13 v1(16.07,22.94)
LED: length 156.8
  Top Layer w0.254: U22.A9 16.32,24.19 16.78,24.65 v1(16.97,24.65)
  Bottom Layer w0.254: 16,21.58 15.89,21.69 U22.B9 ; 16,21.58 16.34,21.93 16.67,21.93 17.41,22.67 17.41,24.2 v1(16.97,24.65) ; 16,21.58 16,21.58 16,21.1 16.77,20.33 16.77,19.86 16.32,19.42 13.32,19.42 12.79,19.95 12.65,19.95 12.07,20.53 12.07,20.67 4.12,28.62 4.12,155.98 IC1.5
LEDOUT: length 173.9
  Top Layer w0.254: v1(10.48,148.04) 10.03,148.04 9.97,147.98 9.48,147.98 9.42,148.04 IC1.9 ; v1(23.43,97.51) v1(14.62,97.51)
  Bottom Layer w0.254: v1(10.48,148.04) 12.7,145.83 12.7,99.44 v1(14.62,97.51) ; U38.6 73.15,10.26 54.72,28.7 54.72,41.52 23.43,72.81 v1(23.43,97.51)
RX: length 210.5
  Top Layer w0.254: 6.35,142.96 7.81,144.42 195.39,144.42 209.09,158.12 AUDIO1.2
SCL: length 355.5
  Top Layer w0.254: v1(188.2,97.02) 186.87,97.02 185.76,95.91 29.83,95.91 24.25,90.33 22.8,90.33 21.41,88.94 ; v1(11.21,93.83) 12.13,92.91 17.44,92.91 21.41,88.94 ; v1(13.06,20.94) 12.3,21.7 12.3,23.55 13.45,24.69 U22.A10 16.03,24.69 16.32,24.99 16.32,36.98 U81.12 ; 10.89,151.22 v1(9.57,151.22) 8.26,151.22 IC1.7 ; 9.65,83.78 11.16,85.29 17.76,85.29 21.41,88.94 ; 210.57,90.89 v1(195.01,90.89)
  Bottom Layer w0.254: v1(13.06,20.94) 13.31,21.19 U22.B10 ; v1(11.21,93.83) 11.21,118.49 9.57,120.13 v1(9.57,151.22) ; v1(188.2,97.02) 194.33,90.89 v1(195.01,90.89) ; U81.12 10.78,42.52 10.78,82.65 9.65,83.78
SDA: length 374.7
  Top Layer w0.254: 10.89,155.15 6.86,155.15 IC1.6 ; U82.13 v1(195.43,88.35) ; U81.13 15.89,34.87 15.89,25.19 15.89,25.19 U22.A11 ; v1(186.62,95.5) 32.49,95.5 19.5,82.51 10.92,82.51 9.65,81.24
  Bottom Layer w0.254: U22.B11 13.64,20.69 13.31,20.36 12.82,20.36 12.48,20.7 12.48,20.84 10.67,22.65 10.67,38.95 ; IC1.6 4.53,153.84 4.53,86.36 9.65,81.24 8.58,80.17 8.58,41.04 10.67,38.95 ; v1(186.62,95.5) 188.28,95.5 v1(195.43,88.35) ; 10.67,38.95 U81.13
TX: length 220.3
  Top Layer w0.254: 6.35,140.42 5.17,141.6 5.17,143.35 6.05,144.23 6.62,144.23 9.14,146.75 135.95,146.75 156.5,167.3 158.73,167.3 159.58,166.44 185.64,166.44 186.5,167.3 188.73,167.3 189.46,166.57 206.95,166.57 208.06,165.45 209.09,165.45 AUDIO1.3
U2_4: length 40.8
  Top Layer w0.254: v1(68.48,162.78) 61.41,155.71 v1(39.07,155.71)
  Bottom Layer w0.254: v1(68.48,162.78) 70.55,160.71 73.92,160.71 U2.4 ; U1.6 38.99,155.79 v1(39.07,155.71)
U3_4: length 42.8
  Top Layer w0.254: v1(69.26,155.26) v1(104.76,155.26)
  Bottom Layer w0.254: v1(69.26,155.26) 68.99,155.53 U2.6 ; U3.4 104.58,159.27 105.61,158.24 105.61,156.11 v1(104.76,155.26)
U4_4: length 39.5
  Top Layer w0.254: v1(129.59,161.6) 123.86,155.88 v1(99.12,155.88)
  Bottom Layer w0.254: U3.6 98.99,156.01 v1(99.12,155.88) ; U4.4 133.91,160.71 130.48,160.71 v1(129.59,161.6)
U5_4: length 46.2
  Bottom Layer w0.254: U5.4 164.58,163.65 160.97,167.26 147.31,167.26 136.01,155.95 129.14,155.95 128.99,156.1 U4.6
U6_4: length 42.6
  Top Layer w0.254: v1(159.29,155.23) v1(194.47,155.23)
  Bottom Layer w0.254: v1(159.29,155.23) 158.99,155.53 U5.6 ; v1(194.47,155.23) 195.49,156.26 195.49,158.35 194.58,159.27 U6.4
U7_4: length 47.7
  Top Layer w0.254: v1(201.09,155.87) v1(189,155.87)
  Bottom Layer w0.254: U6.6 188.99,155.88 v1(189,155.87) ; U7.4 224.58,163.67 220.99,167.25 213.46,167.25 211.43,165.22 208.22,165.22 201.09,158.08 v1(201.09,155.87)
U8_4: length 202.9
  Top Layer w0.254: v1(43.8,141.59) v1(218.31,141.59)
  Bottom Layer w0.254: U7.6 218.99,142.27 v1(218.31,141.59) ; 44.58,130.05 44.58,134.48 42.64,136.42 42.64,140.43 v1(43.8,141.59)
U9_4: length 39.7
  Top Layer w0.254: v1(51.18,131.53) 51.8,130.91 v1(73.65,130.91)
  Bottom Layer w0.254: 74.58,130.05 74.58,130.83 73.73,130.83 v1(73.65,130.91) ; v1(51.18,131.53) 45.72,126.06 39.02,126.06 38.99,126.1 U8.6
U10_4: length 39.6
  Top Layer w0.254: v1(69.02,125.49) 94.32,125.49 v1(99.84,131.01)
  Bottom Layer w0.254: v1(69.02,125.49) 68.99,125.52 U9.6 ; 104.58,130.05 103.91,130.71 100.13,130.71 v1(99.84,131.01)
U11_4: length 47.1
  Top Layer w0.254: v1(106.96,125.49) v1(99.09,125.49) ; v1(113.1,131.62) v1(129.36,131.62)
  Bottom Layer w0.254: v1(99.09,125.49) 98.99,125.59 U10.6 ; v1(129.36,131.62) 129.36,134.3 130.69,135.63 132.65,135.63 134.58,133.7 134.58,130.05 ; v1(106.96,125.49) v1(113.1,131.62)
U12_4: length 39.7
  Top Layer w0.254: v1(159.59,131.18) 153.89,125.49 v1(129.14,125.49)
  Bottom Layer w0.254: v1(159.59,131.18) 160.06,130.71 163.91,130.71 164.58,130.05 ; v1(129.14,125.49) 128.99,125.64 U11.6
U13_4: length 41.2
  Top Layer w0.254: v1(184.91,125.49) v1(159.06,125.49)
  Bottom Layer w0.254: U12.6 158.99,125.56 v1(159.06,125.49) ; 194.58,130.05 194.58,130.83 194.51,130.89 188.3,130.89 184.91,127.5 v1(184.91,125.49)
U14_4: length 44.4
  Top Layer w0.254: v1(215.09,123.17) v1(192,123.17)
  Bottom Layer w0.254: v1(192,123.17) 189.07,126.1 188.99,126.1 U13.6 ; 224.58,130.05 224.58,130.83 224.51,130.89 217.95,130.89 215.09,128.03 v1(215.09,123.17)
U15_4: length 189.9
  Top Layer w0.254: v1(62.6,117.53) v1(216.75,117.53)
  Bottom Layer w0.254: U15.4 45.49,100.05 62.6,117.16 v1(62.6,117.53) ; v1(216.75,117.53) 216.75,123.86 218.99,126.1 U14.6
U16_4: length 46.4
  Top Layer w0.254: v1(38.75,97.85) 38.75,97.19 39.6,96.35 71.13,96.35 v1(75.85,101.07)
  Bottom Layer w0.254: U16.4 80,100.77 76.15,100.77 v1(75.85,101.07) ; U15.6 38.99,97.65 38.95,97.65 v1(38.75,97.85)
U17_4: length 41.4
  Top Layer w0.254: v1(109.72,100.95) 96.42,100.95 91.88,96.41 75.68,96.41 v1(74.21,97.87)
  Bottom Layer w0.254: v1(109.72,100.95) 109.79,100.88 110.66,100.88 U17.4 ; U16.6 75.07,97.71 74.38,97.71 v1(74.21,97.87)
U18_4: length 49.3
  Top Layer w0.254: v1(124.68,96.52) 124.56,96.41 105.68,96.41 104.51,97.58 v1(104.51,97.89)
  Bottom Layer w0.254: U18.4 140.66,103.7 137.02,107.34 133.35,107.34 131.61,105.6 131.61,103.72 124.68,96.79 v1(124.68,96.52) ; U17.6 105.07,97.71 104.68,97.71 v1(104.51,97.89)
U19_4: length 40.1
  Top Layer w0.254: v1(165.67,101.17) 160.9,96.41 135.68,96.41 135.1,96.98 v1(135.1,97.89)
  Bottom Layer w0.254: v1(135.1,97.89) 135.07,97.87 U18.6 ; U19.4 170,100.77 166.07,100.77 v1(165.67,101.17)
U20_4: length 42.6
  Top Layer w0.254: v1(194.9,101.94) 185.58,92.63 v1(168.37,92.63)
  Bottom Layer w0.254: U20.4 200,100.77 196.07,100.77 v1(194.9,101.94) ; U19.6 165.07,95.93 v1(168.37,92.63)
U21_4: length 137.1
  Top Layer w0.254: v1(150.49,52.17) 166.68,52.17 186.04,71.53 v1(186.04,74.52) ; v1(145.29,20.77) 138.77,14.25 v1(119.74,14.25)
  Bottom Layer w0.254: v1(150.49,52.17) 150.49,25.96 v1(145.29,20.77) ; v1(186.04,74.52) 196.13,84.61 196.13,95.09 195.07,96.15 U20.6 ; U21.4 119.38,13.44 119.74,13.8 v1(119.74,14.25)
U23_4: length 94.8
  Bottom Layer w0.254: U21.6 104.36,9.48 44.58,69.27 U23.4
U24_4: length 61
  Top Layer w0.254: v1(44.04,61.05) 85.7,61.05 91.18,66.52 v1(91.18,67.83)
  Bottom Layer w0.254: v1(44.04,61.05) 38.99,66.1 U23.6 ; v1(91.18,67.83) 91.18,68.82 91.58,69.23 U24.4
U25_4: length 40
  Top Layer w0.254: v1(86.14,68.51) 86.14,70.21 86.6,70.67 115.97,70.67 v1(116.75,71.45)
  Bottom Layer w0.254: v1(86.14,68.51) 85.99,68.35 U24.6 ; U25.4 120.92,70.67 117.53,70.67 v1(116.75,71.45)
U26_4: length 40
  Top Layer w0.254: v1(116.04,69.02) 116.04,70.11 116.79,70.86 v1(150.62,70.86)
  Bottom Layer w0.254: v1(150.62,70.86) 150.7,70.79 151.58,70.79 U26.4 ; v1(116.04,69.02) 115.99,68.97 U25.6
U27_4: length 40.7
  Top Layer w0.254: v1(146.21,67.79) 146.21,66.7 146.6,66.31 171.71,66.31 v1(176.6,71.19)
  Bottom Layer w0.254: v1(176.6,71.19) 177,70.79 181.58,70.79 U27.4 ; U26.6 145.99,67.61 146.03,67.61 v1(146.21,67.79)
U28_4: length 40
  Top Layer w0.254: v1(206.95,71.28) 186.4,71.28 180.46,65.34 v1(180.46,65.09)
  Bottom Layer w0.254: v1(180.46,65.09) 176.96,65.09 175.99,66.05 U27.6 ; U28.4 210.92,70.67 207.56,70.67 v1(206.95,71.28)
U29_4: length 73.5
  Bottom Layer w0.254: U28.6 203.13,66.83 181.96,45.66 181.96,34.79 163.45,16.28 U29.4
U30_4: length 142.3
  Top Layer w0.254: v1(44.88,39.05) 46.69,40.86 v1(151.14,40.86)
  Bottom Layer w0.254: U29.6 157.86,10.26 151.14,16.99 v1(151.14,40.86) ; U30.4 44.58,39.27 44.66,39.27 v1(44.88,39.05)
U31_4: length 66.8
  Top Layer w0.254: v1(96.21,41.59) 45.24,41.59 44.6,40.95 40,40.95 38.61,39.56 v1(38.61,39.04)
  Bottom Layer w0.254: U30.6 38.99,38.66 v1(38.61,39.04) ; v1(96.21,41.59) 97.1,40.7 100.45,40.7 U31.4
U31_6: length 46.2
  Bottom Layer w0.254: 95.52,36.86 95.52,36.08 95.55,36.05 110.22,36.05 121.53,47.36 127.35,47.36 131.11,43.61 U32.4
U32_6: length 40.3
  Top Layer w0.254: v1(155.78,41.39) 150.72,36.33 126.13,36.33 125.53,36.93 v1(125.53,37.82)
  Bottom Layer w0.254: v1(125.53,37.82) 125.52,37.81 125.52,36.86 ; v1(155.78,41.39) 156.47,40.7 160.44,40.7 U33.4
U33_6: length 40
  Top Layer w0.254: v1(155.57,39.03) 155.57,40.14 156.32,40.89 v1(190.14,40.89)
  Bottom Layer w0.254: 155.52,36.86 155.52,38.98 v1(155.57,39.03) ; v1(190.14,40.89) 190.22,40.81 191.11,40.81 U34.4
U34_6: length 46.2
  Bottom Layer w0.254: U35.4 221.11,43.69 217.51,47.29 209.38,47.29 198.17,36.08 185.52,36.08 185.52,36.08 185.52,36.86
U35_6: length 27.4
  Bottom Layer w0.254: U36.4 207.9,17.78 215.52,25.4 215.52,36.86
U36_6: length 160.1
  Top Layer w0.254: v1(46.99,13.39) v1(198.76,13.39)
  Bottom Layer w0.254: v1(46.99,13.39) 46.26,12.66 U37.4 ; v1(198.76,13.39) 201.89,10.26 202.31,10.26 202.31,9.48
U37_6: length 46.9
  Top Layer w0.254: v1(79.87,9.7) 79.13,8.96 39.6,8.96 38.8,9.76 v1(38.8,10.46)
  Bottom Layer w0.254: v1(79.87,9.7) 79.87,10.75 78.74,11.88 U38.4 ; v1(38.8,10.46) 38.99,10.27 U37.6
UP: length 117.1
  Top Layer w0.254: v1(9.22,48.05) 5,52.27 5,131.45 IC1.15
  Bottom Layer w0.254: U22.B7 13.83,22.69 13.68,22.54 12.61,22.54 12.31,22.85 12.31,23.55 12.93,24.17 12.93,39.41 12.12,40.22 11.62,40.22 9.22,42.61 v1(9.22,48.05)

## Copper pours and planes (outline as drawn; the poured copper is in the pictures)
GND on Top Layer: -11.43,184.4 242.7,184.4 243.33,183.77 243.33,-6.1 240.67,-8.76 -6.73,-8.76 -12.07,-3.43
GND on Bottom Layer: -12.7,183.77 236.73,183.77 240.67,179.83 240.67,-5.33 235.97,-10.03 -7.37,-10.03 -10.67,-6.73
